# Altium schematic sheet Sheet_1_2021-12-20.schdoc
size 57 x 42 mm
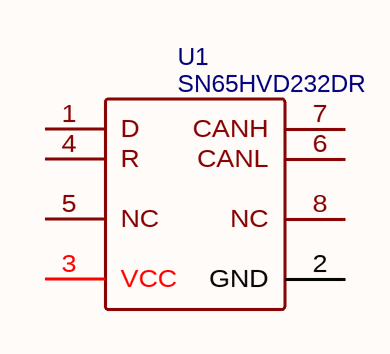
[diagram p0: Sheet_1_2021-12-20.schdoc]

## Parts
U1  SN65HVD232DR  [SOIC-8_L5.0-W4.0-P1.27-LS6.0-BL]

## Nets

Not connected (* = marked no-connect by the designer): U1 1(D) 2(GND) 3(VCC) 4(R) 5(NC) 6(CANL) 7(CANH) 8(NC)

## Library data of the parts
U1 = SN65HVD232DR: BOM_Manufacturer: TI; BOM_Supplier: LCSC; BOM_Manufacturer Part: SN65HVD232DR; BOM_Supplier Part: C30530; BOM_JLCPCB Part Class: Extended Part; spicePre: U; spiceSymbolName: SN65HVD232DR